# Altium schematic sheet Single_stage.SchDoc: Power Stage
size A3; Organization: ORGANIZATION; Address1: ADDRESS 1; Address2: ADDRESS 2; Address3: ADDRESS 3; Address4: ADDRESS 4; Revision: 0.0; SheetNumber: 2; SheetTotal: 19; ENG_APP_DATE: --/--/--; DSN_APP_DATE: --/--/--; CHK_APP_DATE: --/--/--
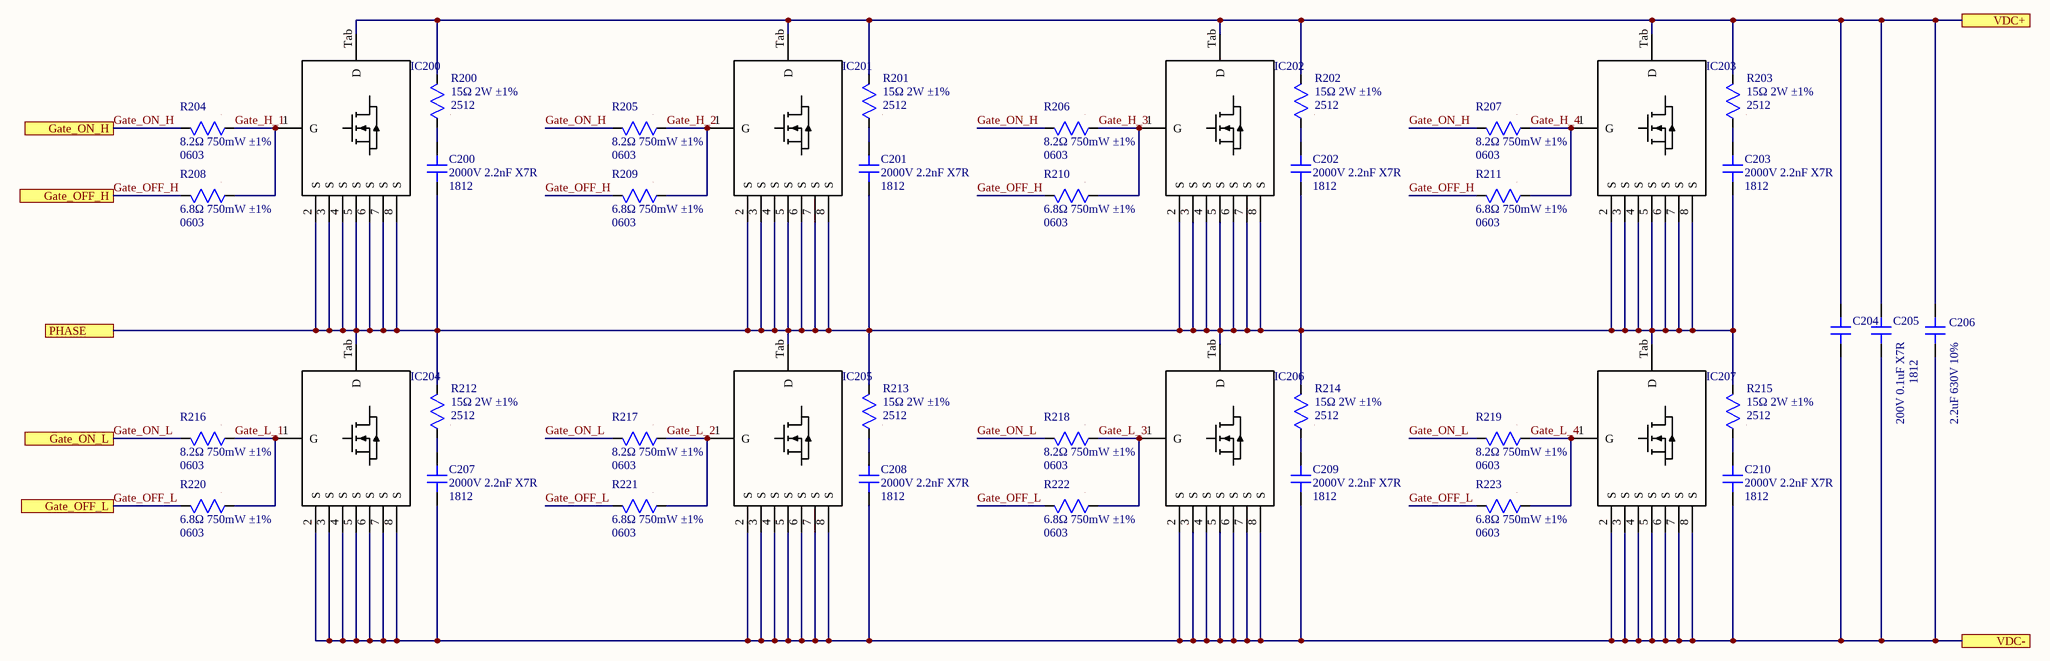
[diagram p0: Single_stage.SchDoc]

## Parts
C200  value 2000V 2.2nF X7R  Package: 1812  [CAP SMD 1812]  (hidden comment: CAP non polarized)
C201  value 2000V 2.2nF X7R  Package: 1812  [CAP SMD 1812]  (hidden comment: CAP non polarized)
C202  value 2000V 2.2nF X7R  Package: 1812  [CAP SMD 1812]  (hidden comment: CAP non polarized)
C203  value 2000V 2.2nF X7R  Package: 1812  [CAP SMD 1812]  (hidden comment: CAP non polarized)
C204  CAP non polarized  [CAP SMD 1812]  (value not drawn)
C205  value 200V 0.1uF X7R  Package: 1812  [CAP SMD 1812]  (hidden comment: CAP non polarized)
C206  value 2.2uF 630V 10%  [CAP_27.5Px30H]  (hidden comment: CAP non polarized)
C207  value 2000V 2.2nF X7R  Package: 1812  [CAP SMD 1812]  (hidden comment: CAP non polarized)
C208  value 2000V 2.2nF X7R  Package: 1812  [CAP SMD 1812]  (hidden comment: CAP non polarized)
C209  value 2000V 2.2nF X7R  Package: 1812  [CAP SMD 1812]  (hidden comment: CAP non polarized)
C210  value 2000V 2.2nF X7R  Package: 1812  [CAP SMD 1812]  (hidden comment: CAP non polarized)
IC200  IAUTN15S6N025  [PG-HSOG-8-1]  (value not drawn)
IC201  IAUTN15S6N025  [PG-HSOG-8-1]  (value not drawn)
IC202  IAUTN15S6N025  [PG-HSOG-8-1]  (value not drawn)
IC203  IAUTN15S6N025  [PG-HSOG-8-1]  (value not drawn)
IC204  IAUTN15S6N025  [PG-HSOG-8-1]  (value not drawn)
IC205  IAUTN15S6N025  [PG-HSOG-8-1]  (value not drawn)
IC206  IAUTN15S6N025  [PG-HSOG-8-1]  (value not drawn)
IC207  IAUTN15S6N025  [PG-HSOG-8-1]  (value not drawn)
R200  value 15Ω 2W ±1%  Package: 2512  [RES SMD 2512]  (hidden comment: RES)
R201  value 15Ω 2W ±1%  Package: 2512  [RES SMD 2512]  (hidden comment: RES)
R202  value 15Ω 2W ±1%  Package: 2512  [RES SMD 2512]  (hidden comment: RES)
R203  value 15Ω 2W ±1%  Package: 2512  [RES SMD 2512]  (hidden comment: RES)
R204  value 8.2Ω 750mW ±1%  Package: 0603  [RES SMD 0603]  (hidden comment: RES)
R205  value 8.2Ω 750mW ±1%  Package: 0603  [RES SMD 0603]  (hidden comment: RES)
R206  value 8.2Ω 750mW ±1%  Package: 0603  [RES SMD 0603]  (hidden comment: RES)
R207  value 8.2Ω 750mW ±1%  Package: 0603  [RES SMD 0603]  (hidden comment: RES)
R208  value 6.8Ω 750mW ±1%  Package: 0603  [RES SMD 0603]  (hidden comment: RES)
R209  value 6.8Ω 750mW ±1%  Package: 0603  [RES SMD 0603]  (hidden comment: RES)
R210  value 6.8Ω 750mW ±1%  Package: 0603  [RES SMD 0603]  (hidden comment: RES)
R211  value 6.8Ω 750mW ±1%  Package: 0603  [RES SMD 0603]  (hidden comment: RES)
R212  value 15Ω 2W ±1%  Package: 2512  [RES SMD 2512]  (hidden comment: RES)
R213  value 15Ω 2W ±1%  Package: 2512  [RES SMD 2512]  (hidden comment: RES)
R214  value 15Ω 2W ±1%  Package: 2512  [RES SMD 2512]  (hidden comment: RES)
R215  value 15Ω 2W ±1%  Package: 2512  [RES SMD 2512]  (hidden comment: RES)
R216  value 8.2Ω 750mW ±1%  Package: 0603  [RES SMD 0603]  (hidden comment: RES)
R217  value 8.2Ω 750mW ±1%  Package: 0603  [RES SMD 0603]  (hidden comment: RES)
R218  value 8.2Ω 750mW ±1%  Package: 0603  [RES SMD 0603]  (hidden comment: RES)
R219  value 8.2Ω 750mW ±1%  Package: 0603  [RES SMD 0603]  (hidden comment: RES)
R220  value 6.8Ω 750mW ±1%  Package: 0603  [RES SMD 0603]  (hidden comment: RES)
R221  value 6.8Ω 750mW ±1%  Package: 0603  [RES SMD 0603]  (hidden comment: RES)
R222  value 6.8Ω 750mW ±1%  Package: 0603  [RES SMD 0603]  (hidden comment: RES)
R223  value 6.8Ω 750mW ±1%  Package: 0603  [RES SMD 0603]  (hidden comment: RES)

## Ports
Gate_OFF_H, Gate_OFF_L, Gate_ON_H, Gate_ON_L, PHASE, VDC+, VDC-

## Nets
Gate_H_1: IC200.1(G) R204.1 R208.1
Gate_H_2: IC201.1(G) R205.1 R209.1
Gate_H_3: IC202.1(G) R206.1 R210.1
Gate_H_4: IC203.1(G) R207.1 R211.1
Gate_L_1: IC204.1(G) R216.1 R220.1
Gate_L_2: IC205.1(G) R217.1 R221.1
Gate_L_3: IC206.1(G) R218.1 R222.1
Gate_L_4: IC207.1(G) R219.1 R223.1
Gate_OFF_H: R208.2 R209.2 R210.2 R211.2 ; port Gate_OFF_H
Gate_OFF_L: R220.2 R221.2 R222.2 R223.2 ; port Gate_OFF_L
Gate_ON_H: R204.2 R205.2 R206.2 R207.2 ; port Gate_ON_H
Gate_ON_L: R216.2 R217.2 R218.2 R219.2 ; port Gate_ON_L
PHASE: C200.2 C201.2 C202.2 C203.2 IC200.2(S) IC200.3(S) IC200.4(S) IC200.5(S) IC200.6(S) IC200.7(S) IC200.8(S) IC201.2(S) IC201.3(S) IC201.4(S) IC201.5(S) IC201.6(S) IC201.7(S) IC201.8(S) IC202.2(S) IC202.3(S) IC202.4(S) IC202.5(S) IC202.6(S) IC202.7(S) IC202.8(S) IC203.2(S) IC203.3(S) IC203.4(S) IC203.5(S) IC203.6(S) IC203.7(S) IC203.8(S) IC204.Tab(D) IC205.Tab(D) IC206.Tab(D) IC207.Tab(D) R212.2 R213.2 R214.2 R215.2 ; port PHASE
VDC+: C204.1 C205.1 C206.1 IC200.Tab(D) IC201.Tab(D) IC202.Tab(D) IC203.Tab(D) R200.2 R201.2 R202.2 R203.2 ; port VDC+
VDC-: C204.2 C205.2 C206.2 C207.2 C208.2 C209.2 C210.2 IC204.2(S) IC204.3(S) IC204.4(S) IC204.5(S) IC204.6(S) IC204.7(S) IC204.8(S) IC205.2(S) IC205.3(S) IC205.4(S) IC205.5(S) IC205.6(S) IC205.7(S) IC205.8(S) IC206.2(S) IC206.3(S) IC206.4(S) IC206.5(S) IC206.6(S) IC206.7(S) IC206.8(S) IC207.2(S) IC207.3(S) IC207.4(S) IC207.5(S) IC207.6(S) IC207.7(S) IC207.8(S) ; port VDC-
NetC200_1: C200.1 R200.1
NetC201_1: C201.1 R201.1
NetC202_1: C202.1 R202.1
NetC203_1: C203.1 R203.1
NetC207_1: C207.1 R212.1
NetC208_1: C208.1 R213.1
NetC209_1: C209.1 R214.1
NetC210_1: C210.1 R215.1

## Notes on the sheet
- Project:
- Subsystem:
- Company:
- Document:
- Author:
- Revision:
- Date:
- Sheet:
- /

## Library data of the parts
C200-C203 C207-C210 = 001-0106: Condensadores de cerámica multicapa (MLCC- SMD/SMT) WCAP-CSMH 2000V 2200pF 1812 10%; MPN: 885342211007; Manufacturer: Wurth Elektronik; ComponentLink1Description: Datasheet; ComponentLink1URL: https://www.we-online.com/components/products/datasheet/885342211007.pdf; ComponentLink2Description: Distributor Link; ComponentLink2URL: https://www.mouser.es/ProductDetail/Wurth-Elektronik/885342211007?qs=MLItCLRbWswJ3Lv4KQFFUA%3D%3D; ID: 001-0106; Distributor PN: 710-885342211007; Distributor: Mouser
C204 = 001-0105: Condensadores de cerámica multicapa (MLCC- SMD/SMT) WCAP-CSMH 200V 0.1uF 1812 10%; MPN: 885342211002; Manufacturer: Wurth Elektronik; Value: 200V 0.1uF X7R; ComponentLink1Description: Datasheet; ComponentLink1URL: https://www.we-online.com/components/products/datasheet/885342211002.pdf; ComponentLink2Description: Distributor Link; ComponentLink2URL: https://www.mouser.es/ProductDetail/Wurth-Elektronik/885342211002?qs=MLItCLRbWsw2aK2K95e6Og%3D%3D; Package: 1812; ID: 001-0105; Distributor PN: 710-885342211002; Distributor: Mouser
C205 = 001-0105: Condensadores de cerámica multicapa (MLCC- SMD/SMT) WCAP-CSMH 200V 0.1uF 1812 10%; MPN: 885342211002; Manufacturer: Wurth Elektronik; ComponentLink1Description: Datasheet; ComponentLink1URL: https://www.we-online.com/components/products/datasheet/885342211002.pdf; ComponentLink2Description: Distributor Link; ComponentLink2URL: https://www.mouser.es/ProductDetail/Wurth-Elektronik/885342211002?qs=MLItCLRbWsw2aK2K95e6Og%3D%3D; ID: 001-0105; Distributor PN: 710-885342211002; Distributor: Mouser
C206 = 004-0001: Condensadores de película WCAP-FTXH 2.2 uF 10% 310V (AC); MPN: 890414027011CS; Manufacturer: Wurth Elektronik; ComponentLink1Description: Datasheet; ComponentLink1URL: https://www.we-online.com/components/products/datasheet/890414027011CS.pdf; ComponentLink2Description: Distributor Link; ComponentLink2URL: https://www.mouser.es/ProductDetail/Wurth-Elektronik/890414027011CS?qs=a2MtRaTmNOQJkBZwIJ39Ww%3D%3D; ID: 004-0001; Package: THT;W16xL32; Distributor PN: 710-890414027011CS; Distributor: Mouser
IC200-IC207 = 043-0001: MOSFET 150 V, N-Ch, 3.8 mOhms max, Automotive MOSFET, TOLT (10x15); MPN: IAUTN15S6N025GATMA1; Manufacturer: Infineon Technologies; Value: N; ComponentLink1Description: Datasheet; ComponentLink1URL: https://www.mouser.es/datasheet/3/70/1/Infineon_IAUTN15S6N025G_DataSheet_v01_00_EN.pdf; ComponentLink2Description: Distributor Link; ComponentLink2URL: https://www.mouser.es/ProductDetail/Infineon-Technologies/IAUTN15S6N025GATMA1?qs=lxPAlgZqN%2Fyxd40SMd9ESg%3D%3D; ID: 043-0001; Package: PG-HSOG-8-1; Distributor PN: 726-IAUTN15S6N025GAT; Distributor: Mouser
R200-R203 R212-R215 = 010-0150: Resistores de película gruesa - SMD CRGP 2512 15R 1% SMD Resistor; MPN: CRGP2512F15R; Manufacturer: TE Connectivity / Holsworthy; ComponentLink1Description: Datasheet; ComponentLink1URL: https://www.te.com/commerce/DocumentDelivery/DDEController?Action=srchrtrv&DocNm=9-1773463-9&DocType=Data%20Sheet&DocLang=English&PartCntxt=2176331-3&DocFormat=pdf; ComponentLink2Description: Distributor Link; ComponentLink2URL: https://www.mouser.es/ProductDetail/TE-Connectivity-Holsworthy/CRGP2512F15R?qs=sGAEpiMZZMtlubZbdhIBIOInyB5Ysv8smEFBCggATNk%3D; ID: 010-0150; Distributor PN: 279-CRGP2512F15R; Distributor: Mouser
R204-R207 R216-R219 = 010-0152: Resistores de película gruesa - SMD 0.75W 8.2ohms 1% High Power AEC-Q200; MPN: CRCW06038R20FKEAHP; Manufacturer: Vishay Intertech; ComponentLink1Description: Datasheet; ComponentLink1URL: https://www.vishay.com/docs/20043/crcwhpe3.pdf; ComponentLink2Description: Distributor Link; ComponentLink2URL: https://www.mouser.es/ProductDetail/Vishay/CRCW06038R20FKEAHP?qs=40TFAHZMFveezrMfyoByGQ%3D%3D; ID: 010-0152; Distributor PN: 71-CRCW06038R20FKEAH; Distributor: Mouser
R208-R211 R220-R223 = 010-0151: Resistores de película gruesa - SMD 0.75W 6.8ohms 1% High Power AEC-Q200; MPN: CRCW06036R80FKEAHP; Manufacturer: Vishay Intertech; ComponentLink1Description: Datasheet; ComponentLink1URL: https://www.vishay.com/docs/20043/crcwhpe3.pdf; ComponentLink2Description: Distributor Link; ComponentLink2URL: https://www.mouser.es/ProductDetail/Vishay/CRCW06036R80FKEAHP?qs=KWN%252BoghGvh0VLghfFgThPw%3D%3D; ID: 010-0151; Distributor PN: 71-CRCW06036R80FKEAH; Distributor: Mouser